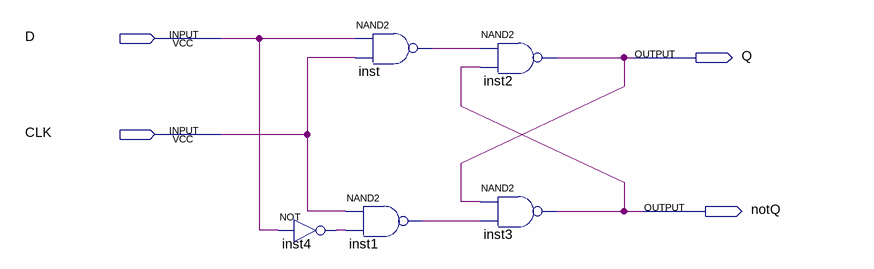
[diagram p0: schematic sheet]
// Quartus schematic gated-D-latch.bdf as structural Verilog: 5 symbols, 4 pins
module \gated-D-latch  (
  input  D,
  input  CLK,
  output Q,
  output notQ
);

  wire inst1_out, inst4_out, inst_out;

  not inst4 (inst4_out, D);
  nand inst (inst_out, D, CLK);
  nand inst1 (inst1_out, CLK, inst4_out);
  nand inst2 (Q, inst_out, notQ);
  nand inst3 (notQ, Q, inst1_out);
endmodule
